# Altium schematic sheet PSU_1084SET_3V3.SchDoc: PSU AP1084KL SET TO 3V3
size A4; Organization: Altium Limited.; Address1: 3 Minna Close; Address2: Belrose; Address3: NSW 2085; Address4: AUSTRALIA; DocumentNumber: 45; SheetNumber: 46; SheetTotal: 77
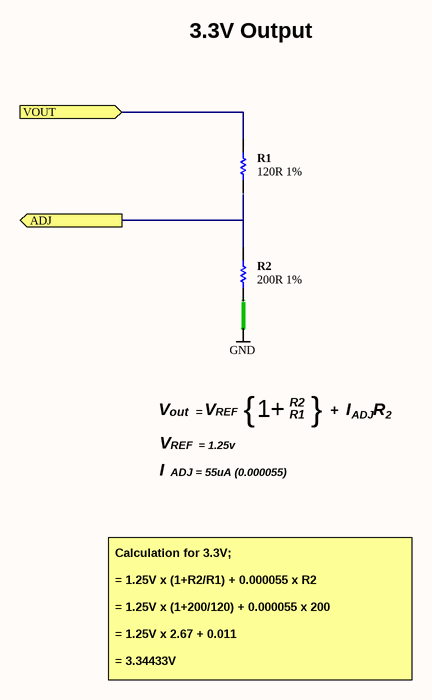
[diagram p0: PSU_1084SET_3V3.SchDoc]

## Parts
R1  120R 1%  [RESC1005-STAR]
R2  200R 1%  [RESC1005-STAR]

## Ports
ADJ (out), VOUT (in)

## Nets
GND: R2.2
ADJ: R1.1 R2.1 ; port ADJ
VOUT: R1.2 ; port VOUT

## Notes on the sheet
- 3.3V Output
- V
- out  =
- REF  = 1.25v
- REF
- {
- 1+
- R2
- R1
- }
- +
- I
- ADJ
- R
- 2
- ADJ = 55uA (0.000055)
- Calculation for 3.3V;
  = 1.25V x (1+R2/R1) + 0.000055 x R2
  = 1.25V x (1+200/120) + 0.000055 x 200
  = 1.25V x 2.67 + 0.011
  = 3.34433V
- Sheet Title
- Project Title
- Size:
- Date:
- A4
- Assy:
- Time:
- Revision:
- Sheet
- of
- File:

## Library data of the parts
R1 = D-100-0126: Resistor, 120R 1% 0402 (1005); Power Rating: 63 mW; Category: Resistor; Mounting Technology: Surface Mount; Resistance: 120 R; Status: Production; Tolerance: 1 %
R2 = D-100-0116: Resistor, 200R 1% 0402 (1005); Power Rating: 63 mW; Mounting Technology: Surface Mount; Resistance: 200 R; Status: Production; Tolerance: 1 %; Category: Resistor